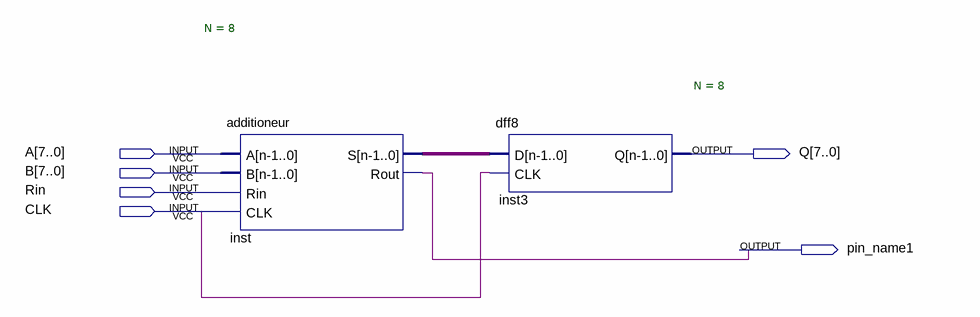
[diagram p0: schematic sheet]
// Quartus schematic addition2Byte.bdf as structural Verilog: 2 symbols, 6 pins
module addition2Byte (
  input  [7:0] A,
  input  [7:0] B,
  input  Rin,
  input  CLK,
  output [7:0] Q,
  output pin_name1
);

  wire inst_rout;
  wire [7:0] inst_s;

  additioneur #(.N(8)) inst (.A(A), .B(B), .Rin(Rin), .CLK(CLK), .S(inst_s), .Rout(inst_rout));
  dff8 #(.N(8)) inst3 (.D(inst_s), .CLK(CLK), .Q(Q));
endmodule
